# EasyEDA Pro project ProProject_运放实验_2024-09-24.epro, board PCB1
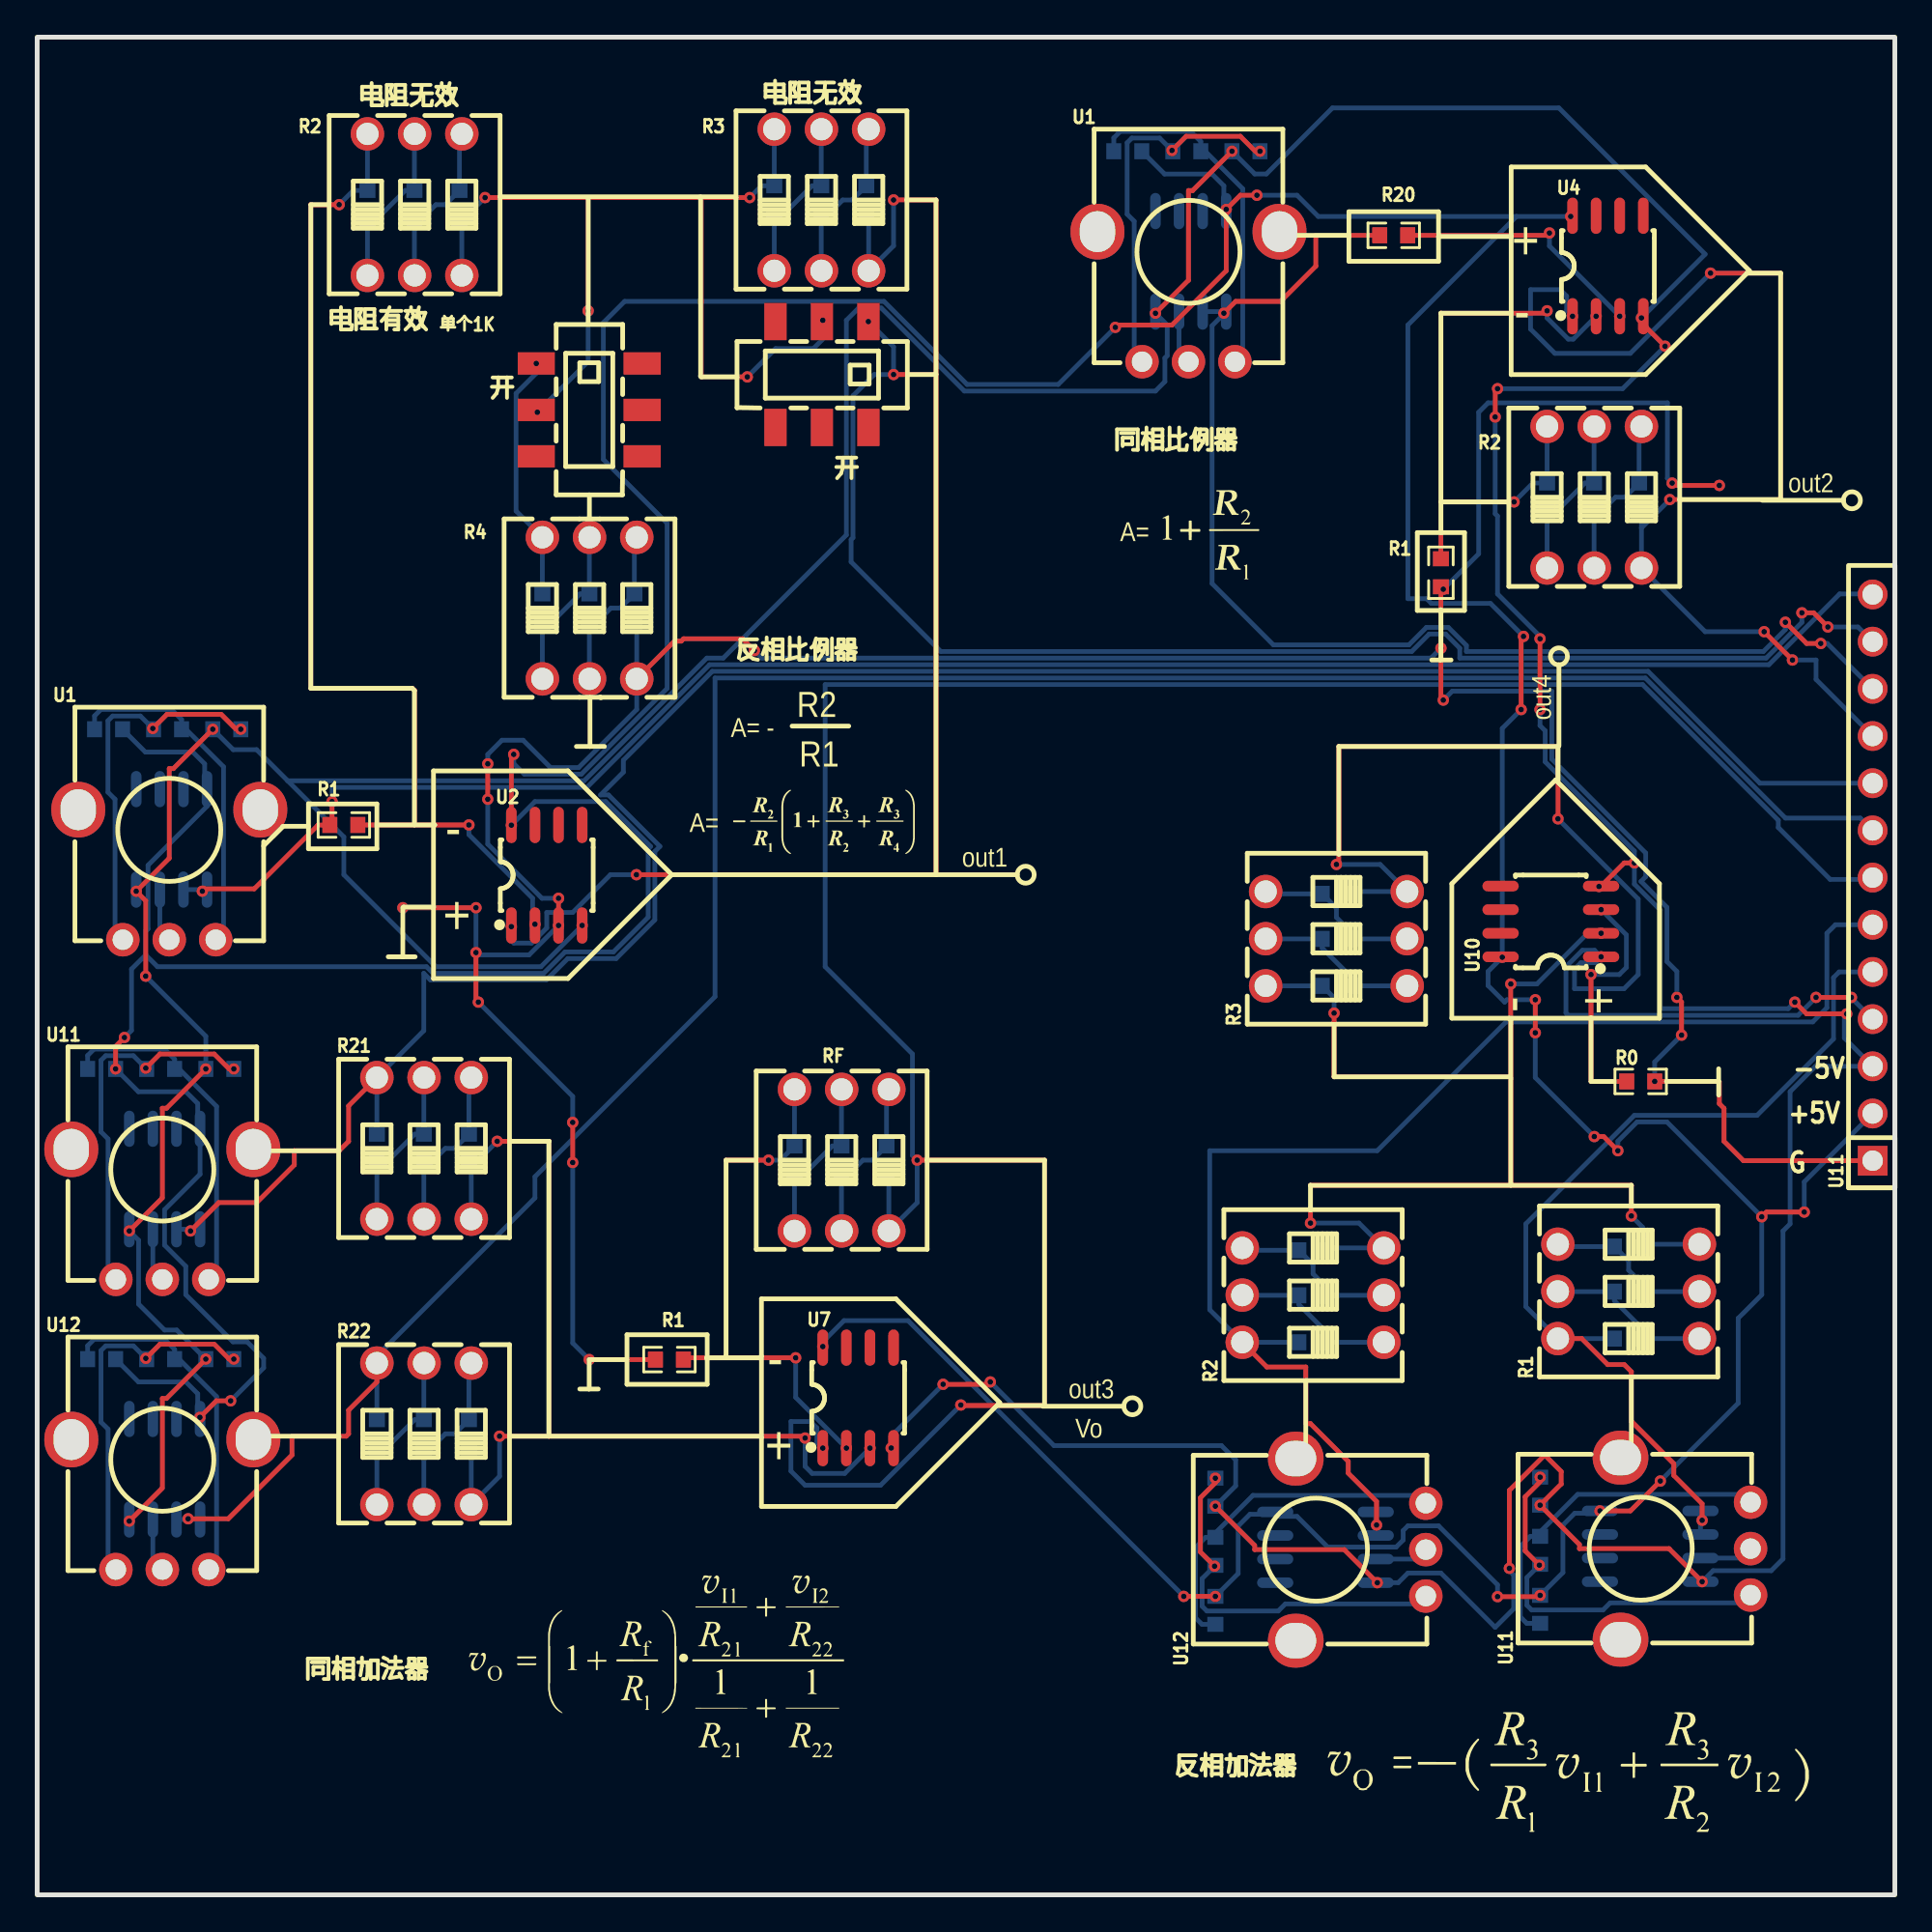
[diagram p7: board, top side]
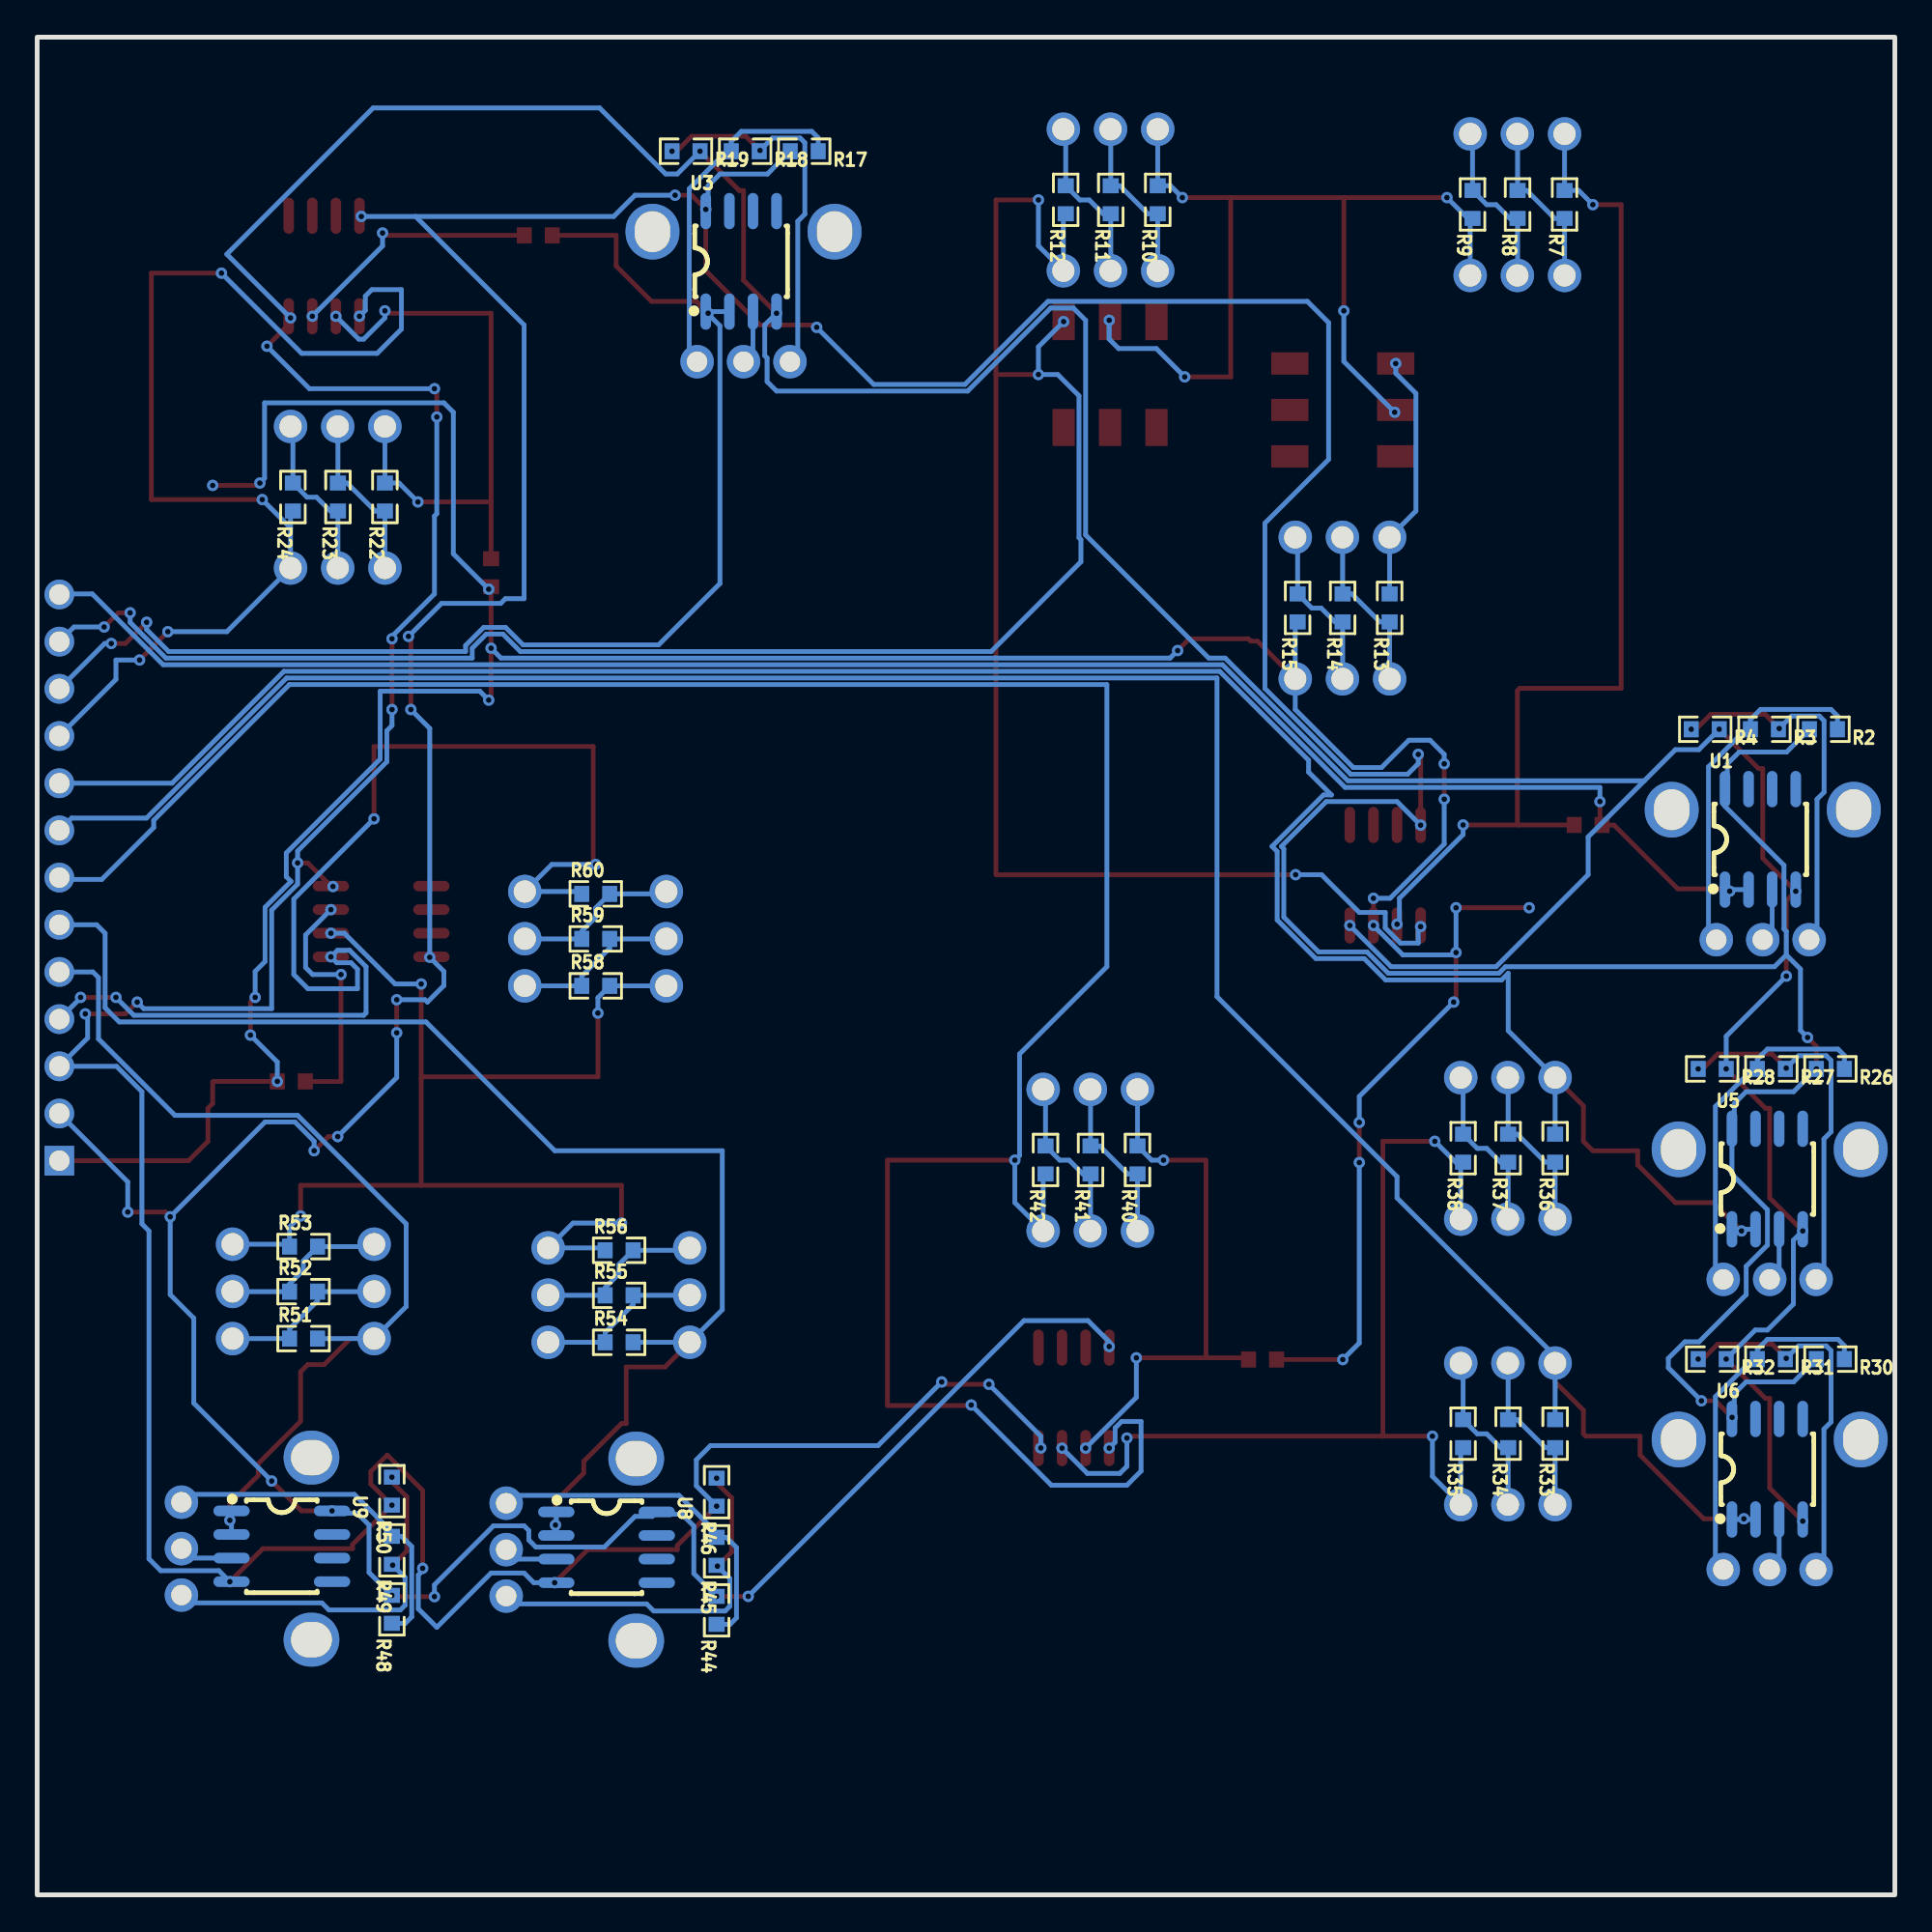
[diagram p8: board, bottom side, seen from below]

Outline 100 x 100 mm; copper layers: Top Layer, Bottom Layer. Coordinates in mm from the lower left corner of the outline.
Outline path: rectangle 0,100 100,0
Stack: Top Layer 0.035mm - / Dielectric1 1.51mm FR4 er 4.5 / Bottom Layer 0.035mm -

## Design rules (mm)
template: JLCPCB Capability(Two Layers Board)
spacing copperThickness1oz (default): track to track 0.102, other pairs 0.152 to 0.3
spacing copperThickness2oz: track to track 0.203, other pairs 0.152 to 0.3
track width copperThickness1oz (default): min 0.127, default 0.254, max 2.54
track width copperThickness2oz: min 0.203, default 0.254, max 2.54
differential pair differentialPair (default): width min 0.127, default 0.254, max 2.54; gap min 0.152, default 0.152
via viaSize (default): diameter min 0.5, default 0.61, max 10; hole min 0.3, default 0.305, max 6.3

## Placement (name value [footprint] x y rotation side)
R0  1kΩ  [R0603]  86.32 43.79 0 top
R1  1kΩ  [R0603]  16.51 57.59 180 top
R1#2  -  [R0603]  75.56 71.17 270 top
R1#3  -  [R0603]  34.04 28.81 180 top
R1#4  -  [SW-TH_DSWB03LHGET]  85.67 32.48 90 top
R2  4kΩ  [SW-TH_DSWB03LHGET]  20.32 90.98 0 top
R2#2  -  [SW-TH_DSWB03LHGET]  83.82 75.23 0 top
R2#3  -  [SW-TH_DSWB03LHGET]  68.68 32.28 90 top
R2#4  -  [R0603]  3.84 62.74 0 bottom
R3  2kΩ  [SW-TH_DSWB03LHGET]  42.22 91.23 0 top
R3#2  -  [SW-TH_DSWB03LHGET]  69.94 51.47 90 top
R3#3  -  [R0603]  7.02 62.74 0 bottom
R4  4kΩ  [SW-TH_DSWB03LHGET]  29.74 69.27 0 top
R4#2  -  [R0603]  10.21 62.74 0 bottom
R7  1kΩ  [R0603]  17.78 90.99 90 bottom
R8  1kΩ  [R0603]  20.31 90.99 90 bottom
R9  1kΩ  [R0603]  22.73 90.99 90 bottom
R10  1kΩ  [R0603]  39.68 91.25 90 bottom
R11  1kΩ  [R0603]  42.21 91.25 90 bottom
R12  1kΩ  [R0603]  44.63 91.25 90 bottom
R13  1kΩ  [R0603]  27.2 69.28 90 bottom
R14  1kΩ  [R0603]  29.72 69.28 90 bottom
R15  1kΩ  [R0603]  32.15 69.28 90 bottom
R17  4kΩ  [R0603]  58.71 93.86 0 bottom
R18  2kΩ  [R0603]  61.89 93.86 0 bottom
R19  4kΩ  [R0603]  65.07 93.86 0 bottom
R20  1kΩ  [R0603]  73.03 89.33 180 top
R21  1kΩ  [SW-TH_DSWB03LHGET]  20.83 40.18 0 top
R22  1kΩ  [SW-TH_DSWB03LHGET]  20.83 24.82 0 top
R22#2  -  [R0603]  81.28 75.25 90 bottom
R23  1kΩ  [R0603]  83.81 75.25 90 bottom
R24  1kΩ  [R0603]  86.23 75.25 90 bottom
R26  4kΩ  [R0603]  3.47 44.46 0 bottom
R27  2kΩ  [R0603]  6.65 44.46 0 bottom
R28  4kΩ  [R0603]  9.83 44.46 0 bottom
R30  4kΩ  [R0603]  3.47 28.84 0 bottom
R31  2kΩ  [R0603]  6.65 28.84 0 bottom
R32  4kΩ  [R0603]  9.83 28.84 0 bottom
R33  1kΩ  [R0603]  18.29 24.83 90 bottom
R34  1kΩ  [R0603]  20.82 24.83 90 bottom
R35  1kΩ  [R0603]  23.24 24.83 90 bottom
R36  1kΩ  [R0603]  18.29 40.19 90 bottom
R37  1kΩ  [R0603]  20.82 40.19 90 bottom
R38  1kΩ  [R0603]  23.24 40.19 90 bottom
R40  1kΩ  [R0603]  40.77 39.56 90 bottom
R41  1kΩ  [R0603]  43.3 39.56 90 bottom
R42  1kΩ  [R0603]  45.72 39.56 90 bottom
R44  4kΩ  [R0603]  63.42 15.31 90 bottom
R45  2kΩ  [R0603]  63.42 18.49 90 bottom
R46  4kΩ  [R0603]  63.42 21.68 90 bottom
R48  4kΩ  [R0603]  80.9 15.37 90 bottom
R49  2kΩ  [R0603]  80.9 18.55 90 bottom
R50  4kΩ  [R0603]  80.9 21.73 90 bottom
R51  1kΩ  [R0603]  85.66 29.94 180 bottom
R52  1kΩ  [R0603]  85.66 32.47 180 bottom
R53  1kΩ  [R0603]  85.66 34.9 180 bottom
R54  1kΩ  [R0603]  68.67 29.74 180 bottom
R55  1kΩ  [R0603]  68.67 32.27 180 bottom
R56  1kΩ  [R0603]  68.67 34.7 180 bottom
R58  1kΩ  [R0603]  69.93 48.93 180 bottom
R59  1kΩ  [R0603]  69.93 51.46 180 bottom
R60  1kΩ  [R0603]  69.93 53.88 180 bottom
RF  DSWB03LHGET  [SW-TH_DSWB03LHGET]  43.31 39.55 0 top
SW31  MST22D18G2  [SW-SMD_MST22D18G2]  29.72 79.93 270 top
SW32  MST22D18G2  [SW-SMD_MST22D18G2]  42.24 81.84 180 top
U1  LM393DR  [RES-ADJ-TH_RK09K1130AJ3]  7.11 54.92 0 top
U1#2  -  [RES-ADJ-TH_RK09K1130AJ3]  61.98 86.03 0 top
U1#3  -  [SOIC-8_L5.0-W4.0-P1.27-LS6.0-BL]  7.24 56.82 180 bottom
U2  LM393DR  [SOIC-8_L5.0-W4.0-P1.27-LS6.0-BL]  27.43 54.89 0 top
U3  LM393DR  [SOIC-8_L5.0-W4.0-P1.27-LS6.0-BL]  62.1 87.93 180 bottom
U4  LM393DR  [SOIC-8_L5.0-W4.0-P1.27-LS6.0-BL]  84.55 87.68 0 top
U5  LM393DR  [SOIC-8_L5.0-W4.0-P1.27-LS6.0-BL]  6.86 38.53 180 bottom
U6  LM393DR  [SOIC-8_L5.0-W4.0-P1.27-LS6.0-BL]  6.86 22.91 180 bottom
U7  LM393DR  [SOIC-8_L5.0-W4.0-P1.27-LS6.0-BL]  44.2 26.75 0 top
U8  LM393DR  [SOIC-8_L5.0-W4.0-P1.27-LS6.0-BL]  69.35 18.71 270 bottom
U9  LM393DR  [SOIC-8_L5.0-W4.0-P1.27-LS6.0-BL]  86.83 18.76 270 bottom
U10  LM393DR  [SOIC-8_L5.0-W4.0-P1.27-LS6.0-BL]  81.48 52.4 90 top
U11  PM254-1-13-Z-8.5  [HDR-TH_13P-P2.54-V-F]  98.81 54.76 90 top
U11#2  -  [RES-ADJ-TH_RK09K1130AJ3]  6.74 36.63 0 top
U11#3  -  [RES-ADJ-TH_RK09K1130AJ3]  88.73 18.64 90 top
U12  -  [RES-ADJ-TH_RK09K1130AJ3]  6.74 21.01 0 top
U12#2  -  [RES-ADJ-TH_RK09K1130AJ3]  71.25 18.58 90 top

## Footprints (pads in the part's own frame, mm; a bottom-side part is the same pattern mirrored in y, then rotated)
HDR-TH_13P-P2.54-V-F
  rect 1.6x1.6 hole 1.1: 1(-15.24,0)
  round 1.6 hole 1.1: 2(-12.7,0) 3(-10.16,0) 4(-7.62,0) 5(-5.08,0) 6(-2.54,0) 7(0,0) 8(2.54,0) 9(5.08,0) 10(7.62,0) 11(10.16,0) 12(12.7,0) 13(15.24,0)
R0603
  rect 0.806x0.864 smd: 1(-0.753,0) 2(0.753,0)
RES-ADJ-TH_RK09K1130AJ3
  round 1.8 hole 1.1: 1(-2.5,-3.5) 2(0,-3.5) 3(2.5,-3.5)
  oval 2.9x3 hole 1.9x2.2: 4(-4.9,3.5) 5(4.9,3.5)
SOIC-8_L5.0-W4.0-P1.27-LS6.0-BL
  oval 0.569x1.95 smd: 1(-1.905,-2.705) 2(-0.635,-2.705) 3(0.635,-2.705) 4(1.905,-2.705) 5(1.905,2.705) 6(0.635,2.705) 7(-0.635,2.705) 8(-1.905,2.705)
SW-SMD_MST22D18G2
  rect 1.2x2 smd: 1(-2.5,2.85) 2(0,2.85) 3(2.5,2.85) 4(-2.5,-2.85) 5(0,-2.85) 6(2.5,-2.85)
SW-TH_DSWB03LHGET
  round 1.8 hole 1.2: 1(-2.54,3.81) 2(0,3.81) 3(2.54,3.81) 4(-2.54,-3.81) 5(0,-3.81) 6(2.54,-3.81)

## Nets
+5V: R2#4.2 R17.2 R26.2 R30.2 R44.2 R48.2 U1#3.8 U2.8 U3.8 U4.8 U5.8 U6.8 U7.8 U8.8 U9.8 U10.8 U11.2
-5V: R4#2.1 R19.1 R28.1 R32.1 R46.1 R50.1 U1#3.4 U2.4 U3.4 U4.4 U5.4 U6.4 U7.4 U8.4 U9.4 U10.4 U11.3
GND: R0.2 R1#2.2 R1#3.2 R4.6 R15.1 U2.3 U11.1
1_FAN_XIANG_BI_LI_QI_IN: R1.2 U1#3.1 U1#3.2 U11.13
1_FAN_XIANG_BI_LI_QI_OUT: R3.6 R12.1 SW32.4 U2.1 U11.12
2_TONG_XIANG_BI_LI_QI_IN: R20.2 U3.1 U3.2 U11.11
2_TONG_XIANG_BI_LI_QI_OUT: R2#2.6 R24.1 U4.1 U11.10
3_TONG_XIANG_JIA_FA_QI_IN1: R21.1 R36.2 U5.1 U5.2 U11.9
3_TONG_XIANG_JIA_FA_QI_IN2: R22.1 R33.2 U6.1 U6.2 U11.8
3_TONG_XIANG_JIA_FA_QI_OUT: R42.1 RF.6 U7.1 U11.7
4_FAN_XIANG_JIA_FA_QI_IN1: R2#3.1 R54.2 U8.1 U8.2 U11.6
4_FAN_XIANG_JIA_FA_QI_IN2: R1#4.1 R51.2 U9.1 U9.2 U11.5
4_FAN_XIANG_JIA_FA_QI_OUT: R3#2.6 R60.1 U10.1 U11.4
$1N396: R2#4.1 R3#3.2 U1.3
$1N406: R3#3.1 R4#2.2 U1.1
$1N426: U1.2 U1#3.3
$1N864: R2.2 R2.4 R7.1 R8.2
$1N884: R2.3 R2.5 R8.1 R9.2
$1N1057: R3.2 R3.4 R10.1 R11.2
$1N1065: R3.3 R3.5 R11.1 R12.2
$1N1238: R4.2 R4.4 R13.1 R14.2
$1N1246: R4.3 R4.5 R14.1 R15.2
$1N1500: R1.1 R2.1 R7.2 U2.2
$1N1717: R4.1 R13.2 SW31.4
$1N1726: R2.6 R3.1 R9.1 R10.2 SW31.5 SW32.5
$1N1964: R17.1 R18.2 U1#2.3
$1N1967: R18.1 R19.2 U1#2.1
$1N1978: U1#2.2 U3.3
$1N2081: R20.1 U4.3
$1N2301: R2#2.2 R2#2.4 R22#2.1 R23.2
$1N2309: R2#2.3 R2#2.5 R23.1 R24.2
$1N2335: R1#2.1 R2#2.1 R22#2.2 U4.2
$1N2569: R26.1 R27.2 U11#2.3
$1N2572: R27.1 R28.2 U11#2.1
$1N2583: U5.3 U11#2.2
$1N2820: R30.1 R31.2 U12.3
$1N2823: R31.1 R32.2 U12.1
$1N2834: U6.3 U12.2
$1N3003: R22.2 R22.4 R33.1 R34.2
$1N3011: R22.3 R22.5 R34.1 R35.2
$1N3184: R21.2 R21.4 R36.1 R37.2
$1N3192: R21.3 R21.5 R37.1 R38.2
$1N3292: R21.6 R22.6 R35.1 R38.1 U7.3
$1N3532: R40.1 R41.2 RF.2 RF.4
$1N3540: R41.1 R42.2 RF.3 RF.5
$1N3559: R1#3.1 R40.2 RF.1 U7.2
$1N4590: R44.1 R45.2 U12#2.3
$1N4593: R45.1 R46.2 U12#2.1
$1N4604: U8.3 U12#2.2
$1N4614: R48.1 R49.2 U11#3.3
$1N4617: R49.1 R50.2 U11#3.1
$1N4628: U9.3 U11#3.2
$1N4635: R1#4.2 R1#4.4 R51.1 R52.2
$1N4643: R1#4.3 R1#4.5 R52.1 R53.2
$1N4651: R2#3.2 R2#3.4 R54.1 R55.2
$1N4659: R2#3.3 R2#3.5 R55.1 R56.2
$1N4698: R3#2.2 R3#2.4 R58.1 R59.2
$1N4706: R3#2.3 R3#2.5 R59.1 R60.2
$1N4742: R1#4.6 R2#3.6 R3#2.1 R53.1 R56.1 R58.2 U10.2
$1N4816: R0.1 U10.3

Pads without a net: SW31 1 2 3 6; SW32 1 2 3 6; U1 4 5; U1#2 4 5; U1#3 5 6 7; U2 5 6 7; U3 5 6 7; U4 5 6 7; U5 5 6 7; U6 5 6 7; U7 5 6 7; U8 5 6 7; U9 5 6 7; U10 5 6 7; U11#2 4 5; U11#3 4 5; U12 4 5; U12#2 4 5

## Via types
v1: diameter 0.61, hole 0.305, Top Layer to Bottom Layer, 144 vias

## Routing (per net, layer and track width the routed paths; a pad name or vN(x,y) marks a point on that pad's centre or on a via; arc(x,y) is an arc through that point)
+5V: length 365.6
  Top Layer w0.254: v1(63.42,16.07) v1(61.72,16.07) ; v1(65.66,91.49) 64.77,91.49 v1(64.01,90.73) 64.01,87.43 61.09,84.51 58.17,84.51 v1(58.04,84.38) ; v1(82.55,90.35) 82.61,90.35 U4.8 ; v1(4.7,46.15) 4.22,45.68 v1(4.22,44.46) ; v1(80.01,67.74) 79.88,67.61 v1(79.88,63.81) ; v1(8.76,25.71) 9.65,26.59 v1(10.41,26.59) ; v1(80.9,16.12) 80.84,16.05 v1(78.61,16.05) ; v1(25.65,61.39) 25.53,61.27 U2.8 v1(25.53,57.58) ; v1(95.12,36.75) 93.09,36.75 v1(92.84,36.5) ; v1(85.09,40.06) 84.33,40.82 v1(83.82,40.82) ; U10.8 78.84,50.49 v1(78.87,50.47) ; v1(42.29,29.51) U7.8 ; v1(80.65,46.41) v1(80.65,48.18) ; v1(87.38,22.28) 85.77,20.67 v1(84.13,20.67)
  Bottom Layer w0.254: v1(80.65,46.41) 80.65,43.99 v1(83.82,40.82) ; v1(80.01,67.74) 78.23,69.52 75.05,69.52 74.79,69.77 73.79,69.77 73.79,84.51 79.63,90.35 ; v1(61.72,16.07) 46.88,30.91 43.43,30.91 42.29,29.77 v1(42.29,29.51) ; v1(80.9,16.12) 82.13,17.35 82.13,19.91 82.77,20.54 84,20.54 v1(84.13,20.67) ; v1(64.01,90.73) U3.8 63.88,90.76 63.88,92 63.25,92.63 60.69,92.63 R17.2 ; v1(79.88,63.81) 78.87,62.79 v1(78.87,50.47) 78.1,49.71 78.1,48.95 78.99,48.06 79.12,48.18 v1(80.65,48.18) ; v1(10.41,26.59) 12.19,28.37 12.19,28.88 11.3,29.77 10.54,29.77 8,32.31 8,33.83 6.86,34.98 6.86,36.88 8.77,38.79 U5.8 8.64,41.36 8.64,42.6 8.01,43.23 5.45,43.23 v1(4.22,44.46) ; 5.84,50.6 5.08,49.83 5.08,46.53 v1(4.7,46.15) ; 5.84,50.6 6.48,49.96 20.96,49.96 21.32,49.61 27.26,49.61 28.42,50.76 31.02,50.76 32.89,52.63 32.89,56.31 33.02,56.44 30.61,58.85 26.8,58.85 v1(25.53,57.58) ; 5.84,50.6 5.84,51.87 5.97,51.99 5.97,55.42 9.14,58.6 U1#3.8 9.02,59.65 9.02,60.88 8.38,61.52 5.83,61.52 R2#4.2 ; v1(25.65,61.39) 25.65,60.9 26.23,60.33 29.3,60.33 33.91,64.94 33.91,73.84 30.48,77.27 30.48,84.63 31.62,85.78 45.59,85.78 50.06,81.31 54.97,81.31 v1(58.04,84.38) ; 79.63,90.35 v1(82.55,90.35) ; 79.63,90.35 68.96,90.35 67.82,91.49 v1(65.66,91.49) ; 8.76,25.62 8.77,25.62 ; 8.76,25.62 v1(8.76,25.71) ; 8.76,25.62 8.64,25.74 8.64,26.98 8.01,27.61 5.45,27.61 R30.2 ; v1(63.42,16.07) 64.65,17.3 64.65,19.85 65.29,20.49 66.52,20.49 U8.8 66.89,20.37 67.82,20.37 69.47,18.72 73.15,18.72 73.53,19.1 73.53,19.61 73.79,19.86 75.44,19.86 78.61,16.69 v1(78.61,16.05) ; v1(95.12,36.75) 95.12,38.38 U11.2 ; v1(85.09,40.06) 85.09,40.57 86.13,41.61 87.73,41.61 v1(92.84,36.5) 92.84,32.31 91.57,31.04 91.57,26.47 v1(87.38,22.28)
-5V: length 365.4
  Top Layer w0.254: v1(4.96,20.12) 6.74,21.9 6.74,26.72 6.96,26.72 v1(9.08,28.84) ; U7.4 45.98,24.05 v1(45.97,24.05) ; v1(60.2,85.14) 61.98,86.92 61.98,91.74 62.2,91.74 v1(64.32,93.86) ; v1(97.41,47.42) 95.25,47.42 v1(94.62,48.06) ; v1(84.07,54.28) 84.16,54.28 U10.4 85.43,55.55 v1(85.98,55.55) ; v1(80.9,63.81) v1(80.9,67.61) ; v1(86.36,84.89) 86.37,84.89 U4.4 86.46,84.53 v1(87.63,83.36) ; v1(78.61,81.08) 78.49,80.95 v1(78.49,79.55) ; v1(89.63,16.86) 87.85,18.64 83.02,18.64 83.02,18.86 v1(80.9,20.98) 82.04,22.12 82.04,22.78 81.15,23.67 79.25,21.77 v1(79.25,17.58) ; v1(4.96,35.74) 6.74,37.52 6.74,42.34 6.96,42.34 v1(9.08,44.46) ; v1(63.42,20.92) 65.54,18.81 65.54,18.58 70.37,18.58 v1(72.14,16.8) ; v1(48.77,27.48) 51.18,27.48 v1(51.31,27.61) ; v1(9.45,62.74) 7.34,60.63 7.11,60.63 7.11,55.8 v1(5.33,54.02) 5.84,53.52 v1(5.84,49.45)
  Bottom Layer w0.254: v1(87.63,83.36) 85.34,81.08 v1(78.61,81.08) ; v1(79.25,17.58) 79.25,17.45 79.48,17.22 79.48,15.4 78.49,14.4 75.56,17.32 73.79,17.32 73.27,16.8 v1(72.14,16.8) U8.4 ; v1(86.36,84.89) 89.79,88.32 81.91,96.19 69.72,96.19 66.17,92.63 65.54,92.63 v1(64.32,93.86) ; v1(63.42,20.92) 64.52,22.02 64.52,23.42 63.75,24.18 54.74,24.18 v1(51.31,27.61) ; U3.4 v1(60.2,85.14) 60.83,84.5 60.83,82.86 60.71,82.73 60.71,81.46 60.2,80.95 49.91,80.95 45.44,85.42 44.22,85.42 43.56,84.76 43.56,73.2 36.93,66.57 36.05,66.57 29.44,59.97 13.49,59.97 ; v1(80.9,67.61) 80.9,67.74 78.61,70.03 78.61,74.22 78.49,74.35 v1(78.49,79.55) ; 13.49,59.97 11.81,61.65 10.55,61.65 v1(9.45,62.74) ; 13.49,59.97 16.51,56.95 16.51,54.92 21.46,49.96 27.12,49.96 v1(29.34,52.18) ; v1(9.08,44.46) 9.08,46.22 v1(5.84,49.45) ; v1(5.33,54.02) U1#3.4 ; v1(48.77,27.48) 45.97,24.69 v1(45.97,24.05) ; v1(97.41,47.42) 97.28,47.3 97.28,46.12 U11.3 95.73,44.6 94.36,43.24 94.36,36.12 93.98,35.74 93.98,18.09 93.34,17.45 90.22,17.45 v1(89.63,16.86) U9.4 ; v1(94.62,48.06) 94.26,47.7 87.38,47.7 87.38,53.01 85.98,54.41 v1(85.98,55.55) 85.98,56.19 81.18,60.99 81.18,62.66 80.9,62.94 v1(80.9,63.81) ; v1(4.96,20.12) U6.4 ; v1(9.08,28.84) 7.51,30.4 6.86,30.4 5.46,31.8 5.46,35.24 v1(4.96,35.74) U5.4
GND: length 190.7
  Top Layer w0.254: v1(88.26,48.31) 88.52,48.06 v1(88.52,46.28) ; v1(75.69,64.31) 75.56,64.44 v1(75.56,67.11) 75.56,70.41 ; v1(87.07,43.79) 90.51,43.79 90.55,43.75 90.55,42.6 90.81,42.34 90.81,40.56 91.85,39.52 U11.1 ; v1(24.26,60.88) v1(24.26,58.98) ; v1(19.69,53.14) v1(23.62,53.14) ; 75.56,70.41 v1(75.69,70.28) ; 75.56,70.41 R1#2.2 ; v1(23.75,48.06) 23.62,48.18 v1(23.62,50.72) ; v1(28.07,53.64) v1(28.07,52.18) ; v1(38.61,66.98) 37.97,67.61 34.8,67.61 34.67,67.49 34.31,67.49 R4.6 ; v1(88.01,76) 88.14,75.87 v1(90.55,75.87) ; R1#3.2 v1(29.72,28.81) ; v1(28.83,41.58) v1(28.83,39.42)
  Bottom Layer w0.254: v1(24.26,60.88) 24.26,61.39 25.02,62.15 26.16,62.15 27.63,60.68 29.15,60.68 32.28,63.81 R4.6 32.28,68.4 R15.1 ; v1(87.07,43.79) 87.07,44.83 v1(88.52,46.28) ; v1(23.75,48.06) 28.83,42.98 v1(28.83,41.58) ; v1(29.72,28.81) 28.83,29.7 v1(28.83,39.42) ; v1(88.01,76) 87.76,76.25 87.76,80.31 78.1,80.31 77.6,79.81 77.6,72.19 v1(75.69,70.28) ; v1(23.62,53.14) v1(23.62,50.72) 23.75,50.6 26.48,50.6 v1(28.07,52.18) ; v1(75.69,64.31) 76.17,64.79 81.53,64.79 81.53,61.14 86.59,56.08 86.59,54.81 86.34,54.55 87.73,53.16 87.73,50.24 88.26,49.71 v1(88.26,48.31) ; v1(28.07,53.64) 27.17,53.64 24.26,56.56 v1(24.26,58.98) ; v1(38.61,66.98) 39.01,66.57 75.03,66.57 v1(75.56,67.11)
1_FAN_XIANG_BI_LI_QI_IN: length 99.2
  Top Layer w0.254: v1(15.88,58.85) 15.88,57.71 R1.2 ; v1(8.89,54.03) 9.02,54.15 11.68,54.15 15.11,57.58 15.88,57.58
  Bottom Layer w0.254: 8.85,54.11 8.85,54.06 v1(8.89,54.03) ; 8.85,54.11 U1#3.2 ; 8.85,54.11 U1#3.1 ; U11.13 98.78,70.03 97.03,70.03 93.22,66.22 36.19,66.22 29.59,59.61 15.88,59.61 v1(15.88,58.85)
1_FAN_XIANG_BI_LI_QI_OUT: length 149.4
  Top Layer w0.254: v1(96.39,68.25) 95.63,69.01 v1(95,69.01) ; v1(46.1,81.84) 48.39,81.84 ; 48.39,81.84 48.39,91.24 v1(46.1,91.24) ; 48.39,81.84 48.39,54.92 v1(32.26,54.92) ; v1(25.53,52.12) U2.1
  Bottom Layer w0.254: R12.1 44.76,90.37 R3.6 46.1,88.77 v1(46.1,91.24) ; v1(96.39,68.25) 98.02,68.25 U11.12 ; v1(32.26,54.92) 30.86,54.92 28.83,52.88 27.43,52.88 27.43,52.05 26.61,51.23 25.65,51.23 25.65,51.99 v1(25.53,52.12) ; v1(95,69.01) 95,68.5 93.07,66.57 76.58,66.57 76.58,67.11 75.82,67.87 74.93,67.87 73.99,66.93 48.64,66.93 43.81,71.76 43.81,72.95 43.92,73.06 43.92,80.7 45.06,81.84 v1(46.1,81.84) 46.1,83.33 v1(44.74,84.69)
2_TONG_XIANG_BI_LI_QI_IN: length 67.8
  Top Layer w0.254: v1(94.11,68.5) 95.25,67.36 v1(96.01,67.36) ; R20.2 68.83,89.33 68.83,87.68 66.93,85.78 64.52,85.78 v1(63.88,85.14)
  Bottom Layer w0.254: 63.92,85.14 U3.1 U3.2 ; 63.92,85.14 v1(63.88,85.14) ; 63.92,85.14 63.25,84.47 63.25,70.59 66.55,67.29 73.84,67.29 74.78,68.22 75.97,68.22 76.94,67.25 76.94,66.93 92.92,66.93 94.11,68.11 v1(94.11,68.5) ; v1(96.01,67.36) 96.37,67.36 U11.11
2_TONG_XIANG_BI_LI_QI_OUT: length 61.5
  Top Layer w0.254: v1(90.08,87.3) 93.85,87.3 93.85,75.11 v1(87.88,75.11) ; v1(94.49,66.47) v1(92.96,68)
  Bottom Layer w0.254: 86.36,73.58 R2#2.6 89.79,68 v1(92.96,68) ; 86.36,73.58 86.36,74.37 R24.1 ; 86.36,73.58 v1(87.88,75.11) ; v1(82.65,84.98) 82.33,85.29 82.33,86.06 81.98,86.41 80.39,86.41 80.39,84.28 81.7,82.98 85.76,82.98 v1(90.08,87.3) ; v1(94.49,66.47) 95.76,66.47 95.76,65.43 U11.10
3_TONG_XIANG_JIA_FA_QI_IN1: length 122.5
  Top Layer w0.254: R21.1 16.76,42.47 16.76,40.56 16.26,40.06 13.84,40.06 13.84,39.29 11.81,37.26 9.78,37.26 v1(8.25,35.74)
  Bottom Layer w0.254: U5.1 8.34,35.83 v1(8.25,35.74) ; R36.2 R21.1 20.81,46.52 20.81,49.61 21.17,49.25 27.41,49.25 28.56,50.4 31.17,50.4 33.25,52.48 33.25,56.16 33.52,56.44 30.75,59.21 30.33,59.21 31.56,60.44 31.56,61.08 36.34,65.86 86.72,65.86 92.74,59.84 U11.9 ; U5.2 8.31,35.83
3_TONG_XIANG_JIA_FA_QI_IN2: length 130.1
  Top Layer w0.254: v1(8.13,20.24) 10.29,20.24 13.72,23.67 13.72,24.69 16.64,24.69 16.76,24.82 16.76,26.09 18.29,27.61 R22.1
  Bottom Layer w0.254: U11.8 98.14,57.96 94.11,57.96 86.57,65.51 36.49,65.51 36.49,48.35 26.8,38.66 26.8,37.52 18.29,29.01 R22.1 R33.2 ; v1(8.13,20.24) 8.12,20.24 8.12,20.21 ; U6.2 8.12,20.21 ; 8.12,20.21 U6.1
3_TONG_XIANG_JIA_FA_QI_OUT: length 137.5
  Top Layer w0.254: v1(49.72,26.37) 49.75,26.34 54.23,26.34 54.23,39.55 v1(47.37,39.55)
  Bottom Layer w0.254: 45.72,38.81 45.85,38.68 45.85,35.74 47.37,37.26 v1(47.37,39.55) 47.12,39.8 47.12,45.26 42.42,49.96 42.42,65.15 86.42,65.15 93.73,57.84 93.73,57.45 96.52,54.66 98.71,54.66 U11.7 ; v1(49.72,26.37) 45.4,22.05 41.34,22.05 40.58,22.81 40.58,25.48 41.63,25.48 41.97,25.13 41.97,24.37 v1(42.29,24.05)
4_FAN_XIANG_JIA_FA_QI_IN1: length 72.7
  Top Layer w0.254: R2#3.1 66.2,28.42 68.29,28.42 68.29,25.37 68.54,25.37 70.58,23.34 70.58,22.7 72.1,21.18 v1(72.1,19.91)
  Bottom Layer w0.254: v1(72.1,19.91) 72.06,19.95 ; 72.06,19.95 U8.1 ; 72.06,19.95 U8.2 ; R54.2 R2#3.1 63.12,31.5 63.12,40.06 72.14,40.06 79.07,46.99 95.58,46.99 96.34,47.75 96.34,51.76 96.8,52.22 U11.6
4_FAN_XIANG_JIA_FA_QI_IN2: length 51.8
  Top Layer w0.254: R1#4.1 83.15,29.94 84.55,28.54 85.44,28.54 85.82,28.16 85.82,25.49 88.1,23.21 88.1,22.57 89.63,21.05 v1(89.63,20.16)
  Bottom Layer w0.254: 89.54,20.16 89.54,20.16 v1(89.63,20.16) ; 89.54,20.16 U9.2 ; 89.54,20.16 U9.1 ; R51.2 R1#4.1 80.14,31.67 80.14,36.12 85.98,41.96 92.58,41.96 96.7,46.08 96.7,49.38 97,49.68 U11.5
4_FAN_XIANG_JIA_FA_QI_OUT: length 68.7
  Top Layer w0.254: v1(97.66,48.31) v1(95.76,48.31) ; v1(81.87,57.92) 81.87,61.82 70.07,61.82 70.07,55.59 v1(69.94,55.47)
  Bottom Layer w0.254: R60.1 70.81,54.01 R3#2.6 72.29,55.47 v1(69.94,55.47) ; v1(81.87,57.92) 86.18,53.6 86.18,49.54 85.42,48.78 82.76,48.78 82.76,49.83 83.1,50.18 83.87,50.18 v1(84.19,50.49) 83.83,50.85 83.18,50.85 82.3,49.96 82.3,47.47 82.42,47.35 94.79,47.35 v1(95.76,48.31) ; U11.4 97.66,48.28 v1(97.66,48.31)
$1N396: length 19
  Bottom Layer w0.254: 7.78,62.98 10.03,60.72 10.03,51.84 U1.3 ; 7.78,62.98 7.78,63.27 7.23,63.81 3.44,63.81 3.09,63.46 R2#4.1 ; 7.78,62.98 R3#3.2
$1N406: length 20.4
  Top Layer w0.254: v1(6.22,62.79) 6.98,63.55 9.91,63.55 10.71,62.74 v1(10.96,62.74)
  Bottom Layer w0.254: v1(6.22,62.79) 6.27,62.74 R3#3.1 5.56,63.46 4.06,63.46 3.81,63.2 3.81,59.36 4.19,58.98 4.19,51.84 U1.1
$1N426: length 2.9
  Bottom Layer w0.254: U1#3.3 6.6,51.92 U1.2
$1N864: length 9.3
  Bottom Layer w0.254: R2.4 R7.1 18.31,90.24 19.81,91.75 R8.2 20.31,94.78 R2.2
$1N884: length 9.2
  Bottom Layer w0.254: R2.3 22.73,94.67 R9.2 21.97,90.98 21.46,90.98 20.72,90.24 R8.1 20.31,87.18 R2.5
$1N1057: length 9.3
  Bottom Layer w0.254: R3.2 42.21,95.03 R11.2 41.71,92 40.21,90.49 R10.1 R3.4
$1N1065: length 9.2
  Bottom Layer w0.254: R3.5 42.21,87.44 R11.1 42.62,90.49 43.36,91.23 43.87,91.23 R12.2 44.63,94.92 R3.3
$1N1238: length 9.3
  Bottom Layer w0.254: R4.4 R13.1 27.72,68.52 29.23,70.03 R14.2 29.72,73.06 R4.2
$1N1246: length 9.2
  Bottom Layer w0.254: R4.5 29.72,65.47 R14.1 30.14,68.52 30.88,69.27 31.38,69.27 R15.2 32.15,72.95 R4.3
$1N1500: length 58.2
  Top Layer w0.254: R1.1 20.27,57.59 ; 20.27,57.59 20.32,57.65 20.32,64.82 20.19,64.95 14.73,64.95 14.73,90.98 v1(16.26,90.98) ; 20.27,57.59 v1(23.24,57.59) ; v1(26.8,52.25) U2.2
  Bottom Layer w0.254: v1(23.24,57.59) 23.24,57.07 26.67,53.64 26.67,52.38 v1(26.8,52.25) ; v1(16.26,90.98) 17.02,91.75 R7.2 R2.1
$1N1717: length 13.4
  Bottom Layer w0.254: R13.2 R4.1 25.78,74.49 25.78,80.82 26.87,81.91 v1(26.87,82.43)
$1N1726: length 54.8
  Top Layer w0.254: v1(26.92,79.81) 26.87,79.86 SW31.5 ; v1(38.23,81.71) 35.75,81.71 35.75,91.36 ; 35.75,91.36 v1(38.35,91.36) ; 35.75,91.36 29.66,91.36 ; SW32.5 42.24,84.71 v1(42.29,84.76) ; 29.66,91.36 v1(29.66,85.27) ; 29.66,91.36 v1(24.11,91.36)
  Bottom Layer w0.254: v1(42.29,84.76) 42.29,83.74 41.78,83.24 39.75,83.24 v1(38.23,81.71) ; 22.86,90.11 v1(24.11,91.36) 24.13,91.36 ; 22.86,90.11 R9.1 ; 22.86,90.11 R2.6 ; R3.1 R10.2 38.99,92 v1(38.35,91.36) ; v1(29.66,85.27) 29.66,82.54 v1(26.92,79.81)
$1N1964: length 19
  Bottom Layer w0.254: 62.64,94.09 64.9,91.84 64.9,82.95 U1#2.3 ; 62.64,94.09 R18.2 ; 62.64,94.09 62.64,94.38 62.09,94.93 58.3,94.93 57.96,94.58 57.96,93.86
$1N1967: length 20.4
  Top Layer w0.254: v1(61.09,93.9) 61.85,94.66 64.77,94.66 65.57,93.86 v1(65.82,93.86)
  Bottom Layer w0.254: U1#2.1 59.06,82.95 59.06,90.09 58.67,90.47 58.67,94.32 58.93,94.57 60.42,94.57 R18.1 61.13,93.86 v1(61.09,93.9)
$1N1978: length 2.9
  Bottom Layer w0.254: U1#2.2 61.47,83.04 U3.3
$1N2081: length 13.7
  Top Layer w0.254: v1(81.41,89.46) 81.28,89.33 R20.1
  Bottom Layer w0.254: v1(85.19,84.98) 81.41,88.76 v1(81.41,89.46)
$1N2301: length 9.3
  Bottom Layer w0.254: R2#2.4 R22#2.1 81.81,74.49 83.31,76 R23.2 83.81,79.03 R2#2.2
$1N2309: length 9.2
  Bottom Layer w0.254: R2#2.3 86.23,78.92 R24.2 85.47,75.23 84.96,75.23 84.22,74.49 R23.1 83.81,71.44 R2#2.5
$1N2335: length 32.2
  Top Layer w0.254: v1(79.5,74.98) 75.56,74.98 ; 75.56,74.98 75.56,85.14 81.15,85.14 v1(81.28,85.27) ; 75.56,74.98 75.56,72.05 75.69,71.92
  Bottom Layer w0.254: v1(79.5,74.98) 80.52,76 R22#2.2 R2#2.1 ; v1(81.28,85.27) 81.28,84.89 82.42,83.74 82.69,83.74 v1(83.92,84.98)
$1N2569: length 19
  Bottom Layer w0.254: 7.4,44.7 R27.2 ; 7.4,44.7 9.66,42.44 9.66,33.55 U11#2.3 ; 7.4,44.7 7.4,44.98 6.86,45.53 3.06,45.53 2.72,45.18 R26.1
$1N2572: length 20.4
  Top Layer w0.254: v1(10.59,44.46) 10.34,44.46 9.53,45.26 6.61,45.26 v1(5.85,44.5)
  Bottom Layer w0.254: v1(5.85,44.5) 5.89,44.46 R27.1 5.18,45.17 3.69,45.17 3.44,44.92 3.44,41.07 3.82,40.69 3.82,33.55 U11#2.1
$1N2583: length 2.9
  Bottom Layer w0.254: U11#2.2 6.23,33.64 U5.3
$1N2820: length 19
  Bottom Layer w0.254: 7.4,29.07 9.66,26.82 9.66,17.93 U12.3 ; 7.4,29.07 R31.2 ; 7.4,29.07 7.4,29.36 6.86,29.91 3.06,29.91 2.72,29.56 R30.1
$1N2823: length 20.4
  Top Layer w0.254: v1(5.85,28.88) 6.61,29.64 9.53,29.64 10.34,28.84 v1(10.59,28.84)
  Bottom Layer w0.254: U12.1 3.82,17.93 3.82,25.07 3.44,25.45 3.44,29.3 3.69,29.55 5.18,29.55 R31.1 5.89,28.84 v1(5.85,28.88)
$1N2834: length 2.9
  Bottom Layer w0.254: U6.3 6.23,18.02 U12.2
$1N3003: length 9.3
  Bottom Layer w0.254: R22.4 18.29,24.07 18.82,24.07 20.32,25.58 R34.2 20.82,28.61 R22.2
$1N3011: length 9.2
  Bottom Layer w0.254: R22.5 20.82,21.02 20.82,24.07 21.23,24.07 21.97,24.82 22.48,24.82 R35.2 23.24,28.5 R22.3
$1N3184: length 9.3
  Bottom Layer w0.254: R21.2 20.82,43.98 R37.2 20.32,40.95 18.82,39.44 R36.1 R21.4
$1N3192: length 9.2
  Bottom Layer w0.254: R21.3 23.24,43.87 R38.2 22.48,40.18 21.97,40.18 21.23,39.44 R37.1 20.82,36.38 R21.5
$1N3292: length 53.4
  Top Layer w0.254: 27.56,24.69 41.24,24.69 v1(41.34,24.59) ; 27.56,24.69 v1(24.89,24.69) ; 27.56,24.69 27.56,40.56 v1(24.77,40.56)
  Bottom Layer w0.254: v1(24.89,24.69) 24.89,22.53 R22.6 23.37,23.95 23.24,24.07 ; 23.37,39.17 23.37,39.31 R38.1 ; 23.37,39.17 R21.6 ; 23.37,39.17 v1(24.77,40.56) ; v1(44.83,24.05) 43.47,22.69 41.72,22.69 41.34,23.07 v1(41.34,24.59)
$1N3532: length 9.3
  Bottom Layer w0.254: RF.4 40.77,38.81 41.29,38.81 42.8,40.31 R41.2 43.3,43.35 RF.2
$1N3540: length 9.2
  Bottom Layer w0.254: 45.85,43.36 45.72,43.23 R42.2 44.96,39.55 44.45,39.55 43.71,38.81 43.3,38.81 43.3,35.75 RF.5
$1N3559: length 29.8
  Top Layer w0.254: v1(40.83,28.91) 36.99,28.91 ; 36.99,28.91 34.88,28.91 R1#3.1 ; 36.99,28.91 37.08,29 37.08,39.55 v1(39.37,39.55)
  Bottom Layer w0.254: v1(39.37,39.55) 40,39.55 R40.2 RF.1 ; v1(43.56,24.05) 40.83,26.78 v1(40.83,28.91)
$1N4590: length 19
  Bottom Layer w0.254: U12#2.3 74.33,21.5 65.44,21.5 63.19,19.25 ; 63.19,19.25 R45.2 ; 63.19,19.25 62.9,19.25 62.36,18.7 62.36,14.91 62.7,14.56 R44.1
$1N4593: length 20.4
  Top Layer w0.254: v1(63.38,17.69) 62.62,18.46 62.62,21.38 63.42,22.18 v1(63.42,22.43)
  Bottom Layer w0.254: U12#2.1 74.33,15.66 67.19,15.66 66.81,15.28 62.97,15.28 62.71,15.53 62.71,17.03 R45.1 63.42,17.73 v1(63.38,17.69)
$1N4604: length 2.9
  Bottom Layer w0.254: U8.3 74.24,18.07 U12#2.2
$1N4614: length 19
  Bottom Layer w0.254: 80.67,19.3 80.38,19.3 79.84,18.75 79.84,14.96 80.18,14.62 R48.1 ; 80.67,19.3 R49.2 ; 80.67,19.3 82.93,21.56 91.81,21.56 U11#3.3
$1N4617: length 20.4
  Top Layer w0.254: v1(80.9,22.48) 80.9,22.23 80.1,21.43 80.1,18.51 v1(80.86,17.75)
  Bottom Layer w0.254: v1(80.86,17.75) 80.9,17.79 R49.1 80.19,17.08 80.19,15.59 80.45,15.33 84.29,15.33 84.67,15.72 91.81,15.72 U11#3.1
$1N4628: length 2.9
  Bottom Layer w0.254: U11#3.2 91.73,18.13 U9.3
$1N4635: length 9.3
  Bottom Layer w0.254: R1#4.2 81.87,32.47 R52.2 84.91,31.98 86.41,30.47 R51.1 R1#4.4
$1N4643: length 9.2
  Bottom Layer w0.254: R1#4.5 89.47,32.47 R52.1 86.41,32.88 85.67,33.63 85.67,34.13 R53.2 81.99,34.9 R1#4.3
$1N4651: length 9.3
  Bottom Layer w0.254: R2#3.2 64.88,32.27 R55.2 67.92,31.78 69.42,30.27 R54.1 R2#3.4
$1N4659: length 9.2
  Bottom Layer w0.254: R2#3.5 72.48,32.27 R55.1 69.42,32.68 68.68,33.43 68.68,33.93 R56.2 65,34.7 R2#3.3
$1N4698: length 9.3
  Bottom Layer w0.254: R3#2.4 R58.1 70.68,49.46 69.18,50.96 R59.2 66.14,51.46 R3#2.2
$1N4706: length 9.2
  Bottom Layer w0.254: R3#2.3 66.26,53.88 R60.2 69.94,53.12 69.94,52.61 70.68,51.87 R59.1 73.74,51.46 R3#2.5
$1N4742: length 68.2
  Top Layer w0.254: 79.33,38.19 85.82,38.19 v1(85.82,36.54) ; 79.33,38.19 68.54,38.19 v1(68.54,36.16) ; 79.33,38.19 79.33,43.95 ; 79.33,43.95 79.24,44.04 69.81,44.04 v1(69.81,47.47) ; 79.33,43.95 v1(79.33,49.03)
  Bottom Layer w0.254: v1(85.82,36.54) 86.41,35.95 R53.1 86.54,35.02 R1#4.6 ; R56.1 69.55,34.82 R2#3.6 71.15,36.16 v1(68.54,36.16) ; v1(84.19,51.76) 83.46,51.76 80.73,49.03 v1(79.33,49.03) ; R3#2.1 R58.2 69.81,48.29 v1(69.81,47.47)
$1N4816: length 13.4
  Top Layer w0.254: v1(83.64,49.54) 83.64,43.79 83.66,43.78 85.56,43.78 R0.1
  Bottom Layer w0.254: v1(84.19,53.03) 85.55,51.67 85.55,49.92 85.17,49.54 v1(83.64,49.54)

## Copper pours and planes (outline as drawn; the poured copper is in the pictures)
GND on Top Layer: 5.46,99.11 95.12,99.11 95.12,0.94 5.46,0.94
GND on Bottom Layer: 5.46,99.11 95.12,99.11 95.12,0.94 5.46,0.94

## Text on the board
Top Silkscreen Layer: +5V | G | -5V | 单个1K | 电阻有效 | 电阻无效 | 开 | 同相加法器 | A= | A= - | 反相比例器 | out1 | out3 | Vo | 同相比例器 | 反相加法器 | out2 | out4 | R2 | R1 | + | -
